# Altium schematic sheet RS232.SchDoc
size A4
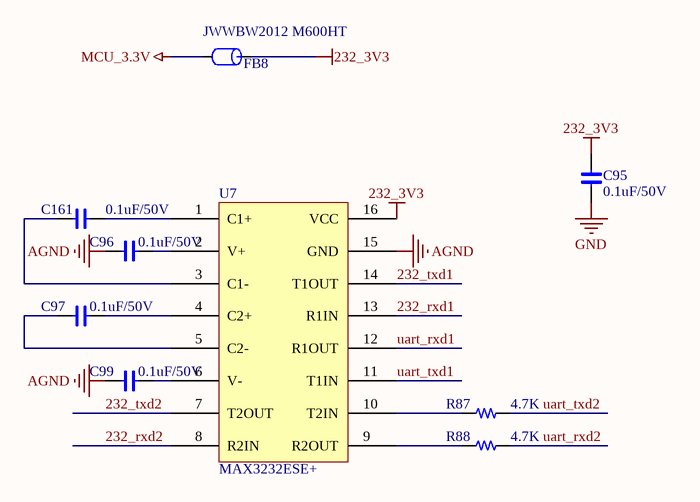
[diagram p0: RS232.SchDoc]

## Parts
C95  0.1uF/50V  [CAPC1608X092N_0603]
C96  0.1uF/50V  [CAPC1608X092N_0603]
C97  0.1uF/50V  [CAPC1608X092N_0603]
C99  0.1uF/50V  [CAPC1608X092N_0603]
C161  0.1uF/50V  [CAPC1608X092N_0603]
FB8  JWWBW2012 M600HT  [0805CZ]
R87  4.7K  [RESC1608X055N_0603]
R88  4.7K  [RESC1608X055N_0603]
U7  MAX3232ESE+  [SOIC127P600X265-16N]

## Nets
232_3V3: C95.1 FB8.1 U7.16(VCC)
AGND: C96.2 C99.2 U7.15(GND)
GND: C95.2
MCU_3.3V: FB8.2
232_rxd1: U7.13(R1IN)
232_rxd2: U7.8(R2IN)
232_txd1: U7.14(T1OUT)
232_txd2: U7.7(T2OUT)
uart_rxd1: U7.12(R1OUT)
uart_rxd2: R88.2
uart_txd1: U7.11(T1IN)
uart_txd2: R87.2
NetC96_1: C96.1 U7.2(V+)
NetC97_1: C97.1 U7.4(C2+)
NetC97_2: C97.2 U7.5(C2-)
NetC99_1: C99.1 U7.6(V-)
NetC161_1: C161.1 U7.1(C1+)
NetC161_2: C161.2 U7.3(C1-)
NetR87_1: R87.1 U7.10(T2IN)
NetR88_1: R88.1 U7.9(R2OUT)

## Library data of the parts
C95-C97 C99 C161 = C: PartNumber: CC0603KRX7R9BB104; Value: 0.1uF/50V; Package: 0603
FB8 = FB: Part Field 1: 磁珠/0603/1K ohm/100MHz; PartNumber: BLM21PG221SN1D; Text Field1: FB; Value: JWWBW2012 M600HT; Package: 0805
R87 R88 = R: PartNumber: RC0603FR-074K7L; Value: 4.7K; Package: 0603
U7 = MAX3232ESE+: Value: MAX3232ESE+; PartNumber: MAX3232ESE+